# EAGLE schematic Stepper_control_schematic_connectors v3 (EAGLE 9.7.0)
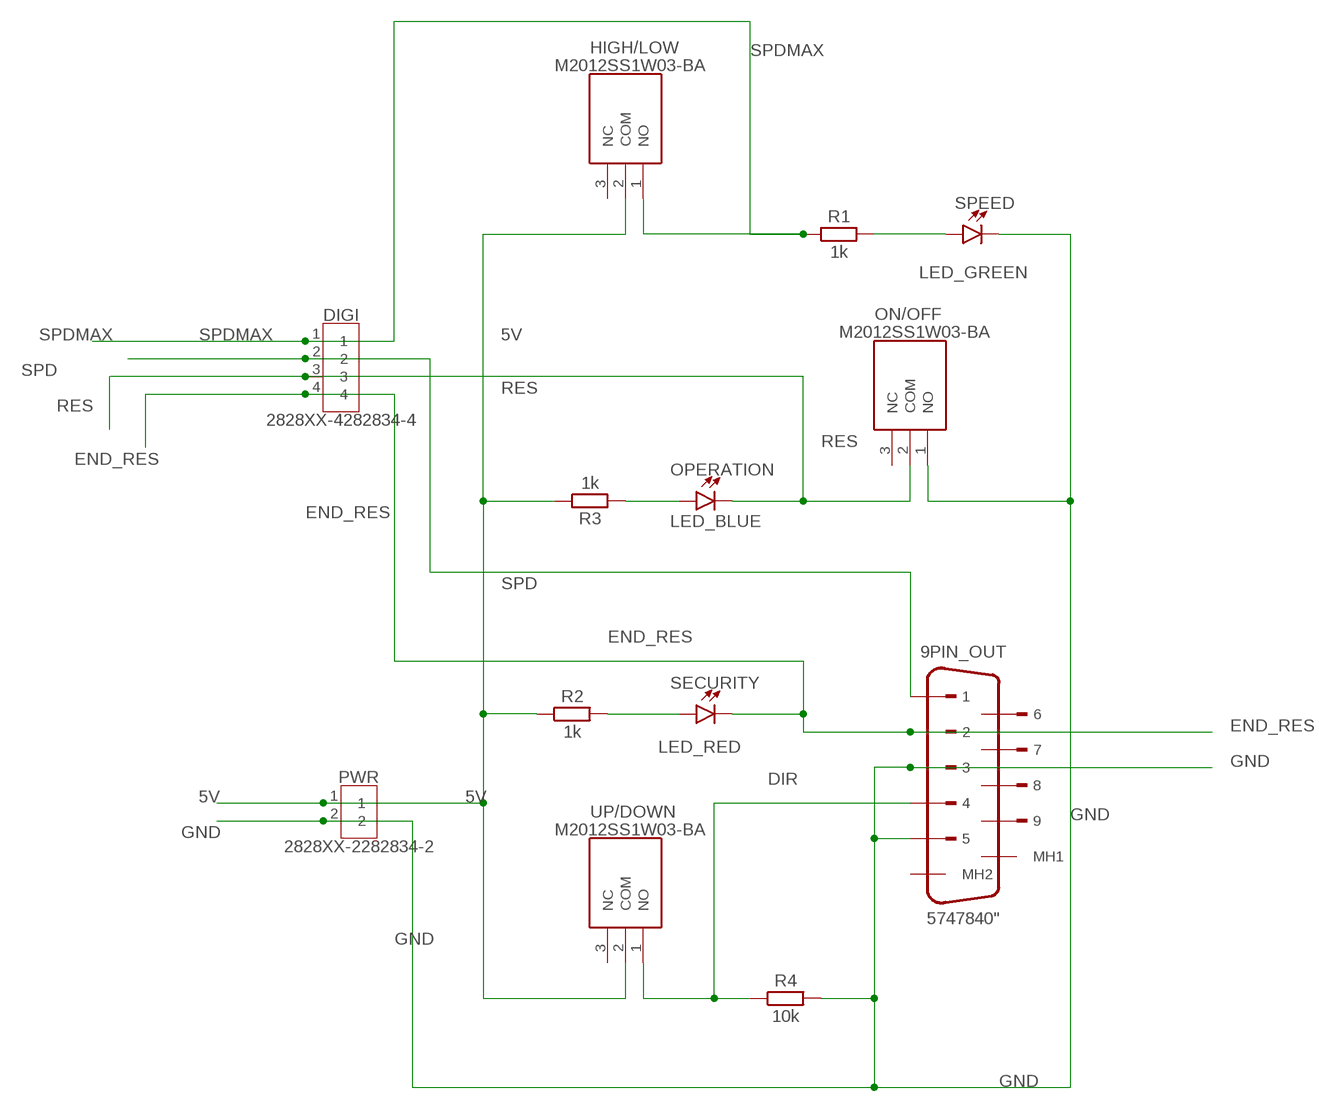
[diagram p0: schematic, sheet 1]

## Parts
9PIN_OUT  5747840"  [5747840-4]
DIGI  2828XX-4282834-4  [TERMBLK_254-4N]
HIGH/LOW  M2012SS1W03-BA  [M2011SS1W03]
ON/OFF  M2012SS1W03-BA  [M2011SS1W03]
OPERATION  LED_BLUE  LED_RADIAL_BLUE  [LEDRD254W60D565H860B_B]
PWR  2828XX-2282834-2  [TERMBLK_254-2N]
R1  1k  R_AXIAL-7.2MM-PITCH  [RESAD724W46L381D178B]
R2  1k  R_AXIAL-7.2MM-PITCH  [RESAD724W46L381D178B]
R3  1k  R_AXIAL-7.2MM-PITCH  [RESAD724W46L381D178B]
R4  10k  R_AXIAL-7.2MM-PITCH  [RESAD724W46L381D178B]
SECURITY  LED_RED  LED_RADIAL_RED  [LEDRD254W60D565H860B]
SPEED  LED_GREEN  LED_RADIAL_GREEN  [LEDRD254W60D565H860B_G]
UP/DOWN  M2012SS1W03-BA  [M2011SS1W03]

## Nets
5V: HIGH/LOW.2(COM) PWR.1 R2.1 R3.1 UP/DOWN.2(COM)
DIR: 9PIN_OUT.4 R4.1 UP/DOWN.1(NO)
END_RES: 9PIN_OUT.2 DIGI.4 SECURITY.2(C)
GND: 9PIN_OUT.3 9PIN_OUT.5 ON/OFF.1(NO) PWR.2 R4.2 SPEED.2(C)
N$2: R2.2 SECURITY.1(A)
N$3: R1.2 SPEED.1(A)
N$6: OPERATION.1(A) R3.2
RES: DIGI.3 ON/OFF.2(COM) OPERATION.2(C)
SPD: 9PIN_OUT.1 DIGI.2
SPDMAX: DIGI.1 HIGH/LOW.1(NO) R1.1
Unconnected: 9PIN_OUT.6 9PIN_OUT.7 9PIN_OUT.8 9PIN_OUT.9 9PIN_OUT.MH1(MH2) 9PIN_OUT.MH2(MH1) HIGH/LOW.3(NC) ON/OFF.3(NC) UP/DOWN.3(NC)

## Library data of the parts
9PIN_OUT = Connector_D-Sub:5747840: D-SUB, 9POS, PLUG, R/A SLDR Datasheet <https://www.te.com/commerce/DocumentDelivery/DDEController?Action=showdoc&DocId=Catalog+Section%7F82068_AMPLIMITE_Right-Angle_Posted_Conn%7F0412%7Fpdf%7FEnglish%7FENG_CS_82068_AMPLIMITE_Right-Angle_Posted_Conn_0412.pdf%7F5747840-4>; CATEGORY: Connector; DESCRIPTION: PCB D-Sub Connectors, Receptacle, Board-to-Board, 9 Position, 2.74mm [.108in] Centerline, 2 Row, Row-to-Row Spacing 2.84 mm [.112 in]; GENDER: Male; MANUFACTURER: TE Connectivity; MPN: 5747840-4; OPERATING_TEMP: -55°C to +105 °C; PART_STATUS: Active; ROHS_COMPLIANT: RoHS Compliant; SERIES: AMPLIMITE HD-20; SUB-CATEGORY: D-SUB; TYPE: R/A
DIGI = Connector:2828XX-4: 4 Position Wire to Board Terminal Block Horizontal with Board Datasheet <https://www.te.com.cn/commerce/DocumentDelivery/DDEController?Action=showdoc&DocId=Catalog+Section%7F1308389_EUROSTYLE_TERMINAL_BLOCKS%7F0607%7Fpdf%7FEnglish%7FENG_CS_1308389_EUROSTYLE_TERMINAL_BLOCKS_0607.pdf%7F2-282837-5>; CATEGORY: Fixed Terminal Blocks; DESCRIPTION: Fixed Terminal Blocks 4P SIDE ENTRY 2.54mm; MANUFACTURER: TE Connectivity AMP Connectors; MPN: 282834-4; OPERATING_TEMPERATURE: -40°C ~ 105°C; PART_STATUS: Active; PITCH: 0.100" (2.54mm); ROHS_COMPLIANCE: RoHS Compliant; SERIES: Buchanan; SUBCATEGORY: Terminal Blocks; TYPE: Through Hole; Screw - Rising Cage Clamp; Side wire entry, Horizontal with Board
HIGH/LOW ON/OFF UP/DOWN = M2012SS1W03-BA:M2012SS1W03-BA: Toggle Switches ON-ON .413 BAT .350 BUSHNG PC BLK CAP 6A Source: Datasheet <https://www.nkkswitches.com/pdf/MtogglesBushing.pdf>; DESCRIPTION: Toggle Switches ON-ON .413 BAT .350 BUSHNG PC BLK CAP 6A; HEIGHT: 28.8mm; MANUFACTURER_NAME: NKK Switches; MANUFACTURER_PART_NUMBER: M2012SS1W03-BA; MOUSER_PART_NUMBER: 633-M2012SS1W03-BA; MOUSER_PRICE-STOCK: https://www.mouser.co.uk/ProductDetail/NKK-Switches/M2012SS1W03-BA?qs=g%252BEszo6zu8OJa%2FL9B16c%2FQ%3D%3D
OPERATION SECURITY SPEED = Tinkercad:LED_RADIAL: LED - Generic; CATEGORY: Opto-Electronic; SUB-CATEGORY: LED
PWR = Connector:2828XX-2: 2 Position Wire to Board Terminal Block Horizontal with Board Datasheet <https://www.te.com.cn/commerce/DocumentDelivery/DDEController?Action=showdoc&DocId=Catalog+Section%7F1308389_EUROSTYLE_TERMINAL_BLOCKS%7F0607%7Fpdf%7FEnglish%7FENG_CS_1308389_EUROSTYLE_TERMINAL_BLOCKS_0607.pdf%7F2-282837-5>; CATEGORY: Fixed Terminal Blocks; DESCRIPTION: Fixed Terminal Blocks 2P SIDE ENTRY 2.54mm; MANUFACTURER: TE Connectivity AMP Connectors; MPN: 282834-2; OPERATING_TEMPERATURE: -40°C ~ 105°C; PART_STATUS: Active; PITCH: 0.100" (2.54mm); ROHS_COMPLIANCE: RoHS Compliant; SERIES: Buchanan; SUBCATEGORY: Terminal Blocks; TYPE: Through Hole; Screw - Rising Cage Clamp; Side wire entry, Horizontal with Board
R1-R4 = Resistor:R: Resistor Fixed - Generic; CATEGORY: Resistor; SUB-CATEGORY: Fixed